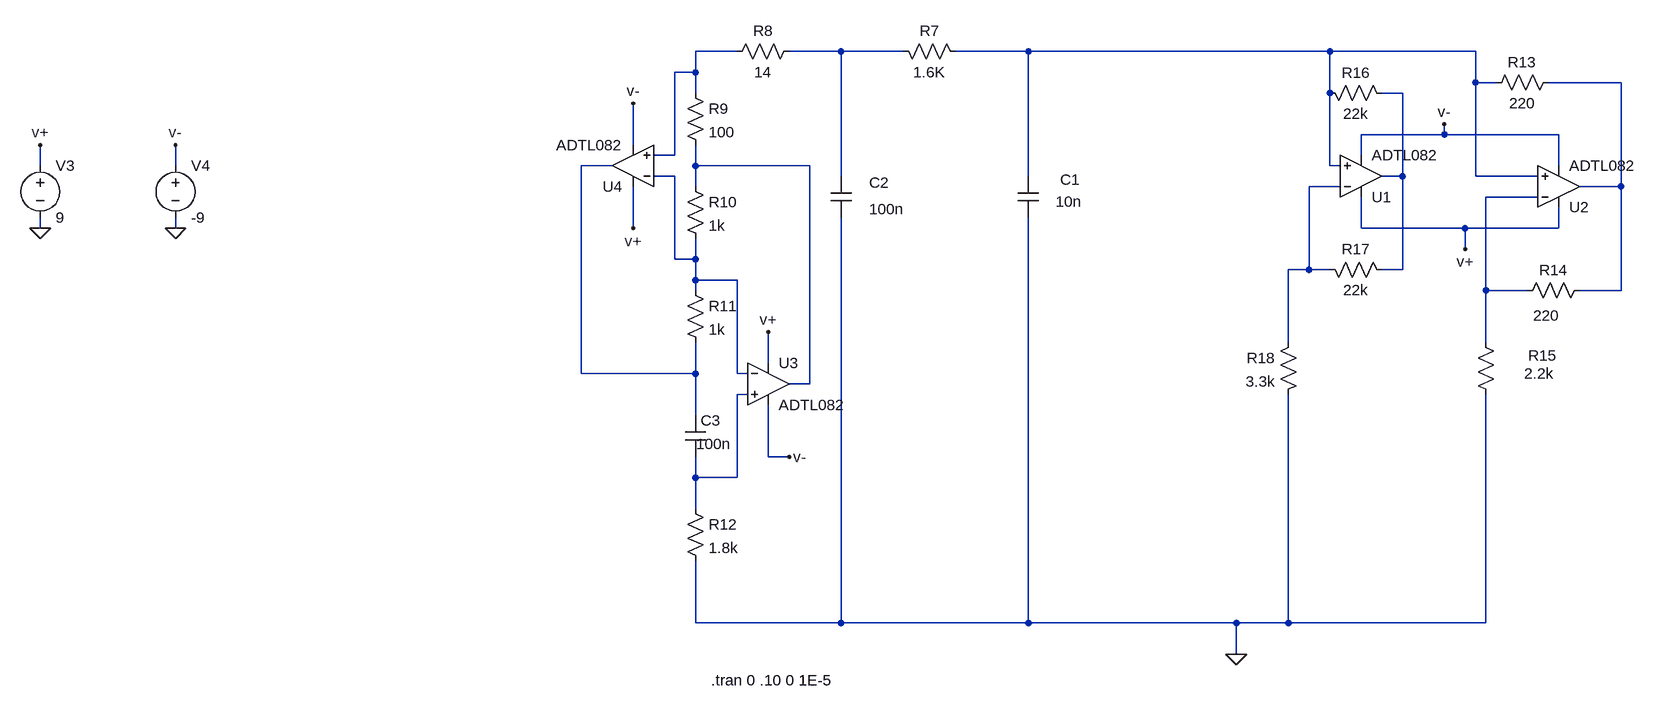
[diagram p0: schematic Draft2.asc]
Draft2.asc, the LTspice schematic file:
Version 4.1
SHEET 1 2508 808
WIRE -144 -176 -208 -176
WIRE 16 -176 -64 -176
WIRE 112 -176 16 -176
WIRE 304 -176 192 -176
WIRE 768 -176 304 -176
WIRE 992 -176 768 -176
WIRE -208 -144 -208 -176
WIRE -208 -144 -240 -144
WIRE 992 -128 992 -176
WIRE 1024 -128 992 -128
WIRE 1216 -128 1104 -128
WIRE -208 -112 -208 -144
WIRE 768 -112 768 -176
WIRE 880 -112 848 -112
WIRE 944 -48 944 -64
WIRE 944 -48 816 -48
WIRE 1120 -48 944 -48
WIRE -304 -32 -304 -96
WIRE -240 -16 -240 -144
WIRE -240 -16 -272 -16
WIRE 816 -16 816 -48
WIRE -1216 0 -1216 -32
WIRE -1008 0 -1008 -32
WIRE -336 0 -384 0
WIRE -208 0 -208 -32
WIRE -32 0 -208 0
WIRE 768 0 768 -112
WIRE 784 0 768 0
WIRE 1120 0 1120 -48
WIRE -240 16 -272 16
WIRE 16 16 16 -176
WIRE 304 16 304 -176
WIRE 880 16 880 -112
WIRE 880 16 848 16
WIRE 992 16 992 -128
WIRE 1088 16 992 16
WIRE -208 32 -208 0
WIRE 784 32 736 32
WIRE 1216 32 1216 -128
WIRE 1216 32 1152 32
WIRE 1088 48 1008 48
WIRE -1216 96 -1216 80
WIRE -1008 96 -1008 80
WIRE -304 96 -304 32
WIRE 816 96 816 48
WIRE 976 96 816 96
WIRE 1120 96 1120 64
WIRE 1120 96 976 96
WIRE 976 128 976 96
WIRE -240 144 -240 16
WIRE -208 144 -208 112
WIRE -208 144 -240 144
WIRE 736 160 736 32
WIRE 736 160 704 160
WIRE 768 160 736 160
WIRE 880 160 880 16
WIRE 880 160 848 160
WIRE -208 176 -208 144
WIRE -144 176 -208 176
WIRE -208 192 -208 176
WIRE 1008 192 1008 48
WIRE 1072 192 1008 192
WIRE 1216 192 1216 32
WIRE 1216 192 1152 192
WIRE 704 272 704 160
WIRE 1008 272 1008 192
WIRE -96 304 -96 256
WIRE -384 320 -384 0
WIRE -208 320 -208 272
WIRE -208 320 -384 320
WIRE -144 320 -144 176
WIRE -128 320 -144 320
WIRE -32 336 -32 0
WIRE -32 336 -64 336
WIRE -128 352 -144 352
WIRE -208 384 -208 320
WIRE -96 448 -96 368
WIRE -64 448 -96 448
WIRE -208 480 -208 448
WIRE -144 480 -144 352
WIRE -144 480 -208 480
WIRE -208 528 -208 480
WIRE -208 704 -208 608
WIRE 16 704 16 80
WIRE 16 704 -208 704
WIRE 304 704 304 80
WIRE 304 704 16 704
WIRE 624 704 304 704
WIRE 704 704 704 352
WIRE 704 704 624 704
WIRE 1008 704 1008 352
WIRE 1008 704 704 704
WIRE 624 752 624 704
FLAG -1216 96 0
FLAG -1008 96 0
FLAG -1216 -32 v+
FLAG -304 96 v+
FLAG -96 256 v+
FLAG -1008 -32 v-
FLAG -304 -96 v-
FLAG -64 448 v-
FLAG 944 -64 v-
FLAG 976 128 v+
FLAG 624 752 0
SYMBOL res 208 -160 M270
WINDOW 0 32 56 VTop 2
WINDOW 3 0 56 VBottom 2
SYMATTR InstName R7
SYMATTR Value 1.6K
SYMATTR SpiceLine tol=5 pwr=1
SYMBOL cap 288 16 R0
WINDOW 0 65 5 Left 2
WINDOW 3 58 39 Left 2
SYMATTR InstName C1
SYMATTR Value 10n
SYMATTR SpiceLine V=100
SYMBOL cap 0 16 R0
WINDOW 0 59 10 Left 2
WINDOW 3 59 51 Left 2
SYMATTR InstName C2
SYMATTR Value 100n
SYMATTR SpiceLine V=100
SYMBOL res -48 -192 R90
WINDOW 0 0 56 VBottom 2
WINDOW 3 32 56 VTop 2
SYMATTR InstName R8
SYMATTR Value 14
SYMBOL res -224 -128 R0
SYMATTR InstName R9
SYMATTR Value 100
SYMBOL res -224 16 R0
SYMATTR InstName R10
SYMATTR Value 1k
SYMBOL res -224 176 R0
SYMATTR InstName R11
SYMATTR Value 1k
SYMBOL res -224 512 R0
SYMATTR InstName R12
SYMATTR Value 1.8k
SYMBOL cap -224 384 R0
WINDOW 3 17 44 Left 2
SYMATTR Value 100n
SYMATTR InstName C3
SYMBOL OpAmps\\ADTL082 -96 272 R0
SYMATTR InstName U3
SYMBOL OpAmps\\ADTL082 -304 64 R180
SYMATTR InstName U4
SYMBOL voltage -1216 -16 R0
WINDOW 123 0 0 Left 0
WINDOW 39 0 0 Left 0
SYMATTR InstName V3
SYMATTR Value 9
SYMBOL voltage -1008 -16 R0
WINDOW 123 0 0 Left 0
WINDOW 39 0 0 Left 0
SYMATTR InstName V4
SYMATTR Value -9
SYMBOL res 1008 -112 R270
WINDOW 0 32 56 VTop 2
WINDOW 3 0 56 VBottom 2
SYMATTR InstName R13
SYMATTR Value 220
SYMATTR SpiceLine tol=5 pwr=1
SYMBOL res 1056 208 R270
WINDOW 0 32 56 VTop 2
WINDOW 3 -7 45 VBottom 2
SYMATTR InstName R14
SYMATTR Value 220
SYMATTR SpiceLine tol=5 pwr=1
SYMBOL res 992 256 R0
WINDOW 0 81 36 Left 2
WINDOW 3 75 64 Left 2
SYMATTR InstName R15
SYMATTR Value 2.2k
SYMATTR SpiceLine tol=5 pwr=1
SYMBOL res 864 -96 M270
WINDOW 0 32 56 VTop 2
WINDOW 3 0 56 VBottom 2
SYMATTR InstName R16
SYMATTR Value 22k
SYMATTR SpiceLine tol=5 pwr=1
SYMBOL res 864 176 M270
WINDOW 0 32 56 VTop 2
WINDOW 3 0 56 VBottom 2
SYMATTR InstName R17
SYMATTR Value 22k
SYMATTR SpiceLine tol=5 pwr=1
SYMBOL res 720 256 M0
SYMATTR InstName R18
SYMATTR Value 3.3k
SYMATTR SpiceLine tol=5 pwr=1
SYMBOL OpAmps\\ADTL082 816 80 M180
SYMATTR InstName U1
SYMBOL OpAmps\\ADTL082 1120 96 M180
SYMATTR InstName U2
TEXT -184 792 Left 2 !.tran 0 .10 0 1E-5

The netlist it stands for:
* Draft2.asc
R7 N003 N002 1.6K tol=5 pwr=1
C1 N003 0 10n V=100
C2 N002 0 100n V=100
R8 N002 N001 14
R9 N001 N007 100
R10 N007 N008 1k
R11 N008 N006 1k
R12 N011 0 1.8k
C3 N006 N011 100n
X§U3 N011 N008 v+ v- N007 ADTL082  ; pins In+ In- V+ V- OUT
X§U4 N001 N008 v+ v- N006 ADTL082  ; pins In+ In- V+ V- OUT
V3 v+ 0 9
V4 v- 0 -9
R13 N003 N004 220 tol=5 pwr=1
R14 N010 N004 220 tol=5 pwr=1
R15 N010 0 2.2k tol=5 pwr=1
R16 N005 N003 22k tol=5 pwr=1
R17 N005 N009 22k tol=5 pwr=1
R18 N009 0 3.3k tol=5 pwr=1
X§U1 N003 N009 v+ v- N005 ADTL082  ; pins In+ In- V+ V- OUT
X§U2 N003 N010 v+ v- N004 ADTL082  ; pins In+ In- V+ V- OUT
.tran 0 .10 0 1E-5
.lib ADI.lib
.backanno
.end